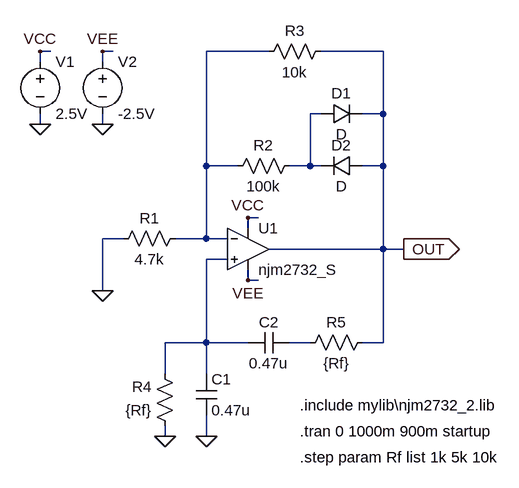
[diagram p0: schematic Wien bridge NJM2732freq.asc]
Wien bridge NJM2732freq.asc, the LTspice schematic file:
Version 4
SHEET 1 880 852
WIRE -48 192 -64 192
WIRE 48 192 32 192
WIRE 288 192 192 192
WIRE 464 192 368 192
WIRE -64 208 -64 192
WIRE 32 208 32 192
WIRE 368 288 352 288
WIRE 464 288 464 192
WIRE 464 288 432 288
WIRE -64 304 -64 288
WIRE 32 304 32 288
WIRE 192 368 192 192
WIRE 240 368 192 368
WIRE 352 368 352 288
WIRE 352 368 320 368
WIRE 368 368 352 368
WIRE 464 368 464 288
WIRE 464 368 432 368
WIRE 272 448 256 448
WIRE 256 464 256 448
WIRE 64 480 32 480
WIRE 192 480 192 368
WIRE 192 480 144 480
WIRE 224 480 192 480
WIRE 464 496 464 368
WIRE 464 496 288 496
WIRE 496 496 464 496
WIRE 224 512 192 512
WIRE 256 544 256 528
WIRE 272 544 256 544
WIRE 32 560 32 480
WIRE 192 640 192 512
WIRE 192 640 128 640
WIRE 256 640 192 640
WIRE 352 640 320 640
WIRE 464 640 464 496
WIRE 464 640 432 640
WIRE 128 688 128 640
WIRE 192 688 192 640
WIRE 128 784 128 768
WIRE 192 784 192 752
FLAG 128 784 0
FLAG 192 784 0
FLAG -64 304 0
FLAG 32 304 0
FLAG -64 192 VCC
FLAG 32 192 VEE
FLAG 256 448 VCC
FLAG 256 544 VEE
FLAG 32 560 0
FLAG 496 496 OUT
IOPIN 496 496 Out
SYMBOL res 160 464 R90
WINDOW 0 0 56 VBottom 2
WINDOW 3 32 56 VTop 2
SYMATTR InstName R1
SYMATTR Value 4.7k
SYMBOL res 336 352 R90
WINDOW 0 0 56 VBottom 2
WINDOW 3 32 56 VTop 2
SYMATTR InstName R2
SYMATTR Value 100k
SYMBOL diode 368 304 R270
WINDOW 0 32 32 VTop 2
WINDOW 3 0 32 VBottom 2
SYMATTR InstName D1
SYMBOL diode 432 352 R90
WINDOW 0 0 32 VBottom 2
WINDOW 3 32 32 VTop 2
SYMATTR InstName D2
SYMBOL res 384 176 R90
WINDOW 0 0 56 VBottom 2
WINDOW 3 32 56 VTop 2
SYMATTR InstName R3
SYMATTR Value 10k
SYMBOL res 144 784 R180
WINDOW 0 36 76 Left 2
WINDOW 3 36 40 Left 2
SYMATTR InstName R4
SYMATTR Value {Rf}
SYMBOL res 336 656 R270
WINDOW 0 32 56 VTop 2
WINDOW 3 0 56 VBottom 2
SYMATTR InstName R5
SYMATTR Value {Rf}
SYMBOL cap 176 688 R0
SYMATTR InstName C1
SYMATTR Value 0.47u
SYMBOL cap 320 624 R90
WINDOW 0 0 32 VBottom 2
WINDOW 3 32 32 VTop 2
SYMATTR InstName C2
SYMATTR Value 0.47u
SYMBOL voltage -64 192 R0
WINDOW 123 0 0 Left 2
WINDOW 39 0 0 Left 2
SYMATTR InstName V1
SYMATTR Value 2.5V
SYMBOL voltage 32 192 R0
WINDOW 123 0 0 Left 2
WINDOW 39 0 0 Left 2
SYMATTR InstName V2
SYMATTR Value -2.5V
SYMBOL Opamps\\opamp2 256 432 R0
SYMATTR InstName U1
SYMATTR Value njm2732_S
TEXT 336 776 Left 2 !.tran 0 1000m 900m startup
TEXT 336 736 Left 2 !.include mylib\\njm2732_2.lib
TEXT 336 816 Left 2 !.step param Rf list 1k 5k 10k

The netlist it stands for:
* Wien bridge NJM2732freq.asc
R1 N001 0 4.7k
R2 N002 N001 100k
D1 N002 OUT D
D2 OUT N002 D
R3 OUT N001 10k
R4 0 N003 {Rf}
R5 N004 OUT {Rf}
C1 N003 0 0.47u
C2 N004 N003 0.47u
V1 VCC 0 2.5V
V2 VEE 0 -2.5V
XU1 N003 N001 VCC VEE OUT njm2732_S  ; pins In+ In- V+ V- OUT
.model D D
.lib standard.dio
.tran 0 1000m 900m startup
.include mylib\njm2732_2.lib
.step param Rf list 1k 5k 10k
.backanno
.end